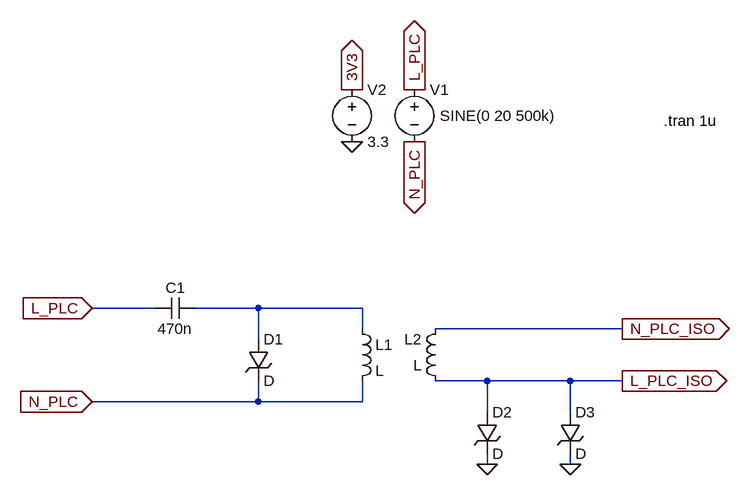
[diagram p0: schematic scratch.asc]
scratch.asc, the LTspice schematic file:
Version 4.1
SHEET 1 980 680
WIRE 64 80 -32 80
WIRE 224 80 128 80
WIRE 384 80 224 80
WIRE 384 112 384 80
WIRE 784 112 496 112
WIRE 224 128 224 80
WIRE 576 192 496 192
WIRE 704 192 576 192
WIRE 784 192 704 192
WIRE 224 224 224 192
WIRE 224 224 -32 224
WIRE 384 224 384 192
WIRE 384 224 224 224
WIRE 576 240 576 192
WIRE 704 240 704 192
WIRE 576 320 576 304
WIRE 704 320 704 304
FLAG -32 80 L_PLC
IOPIN -32 80 In
FLAG -32 224 N_PLC
IOPIN -32 224 In
FLAG 784 112 N_PLC_ISO
IOPIN 784 112 Out
FLAG 784 192 L_PLC_ISO
IOPIN 784 192 Out
FLAG 576 320 0
FLAG 464 -256 L_PLC
IOPIN 464 -256 Out
FLAG 464 -176 N_PLC
IOPIN 464 -176 Out
FLAG 368 -256 3V3
IOPIN 368 -256 Out
FLAG 368 -176 0
FLAG 704 320 0
SYMBOL cap 128 64 R90
WINDOW 0 0 32 VBottom 2
WINDOW 3 32 32 VTop 2
SYMATTR InstName C1
SYMATTR Value 470n
SYMBOL ind 512 208 R180
WINDOW 0 36 80 Left 2
WINDOW 3 36 40 Left 2
SYMATTR InstName L2
SYMBOL voltage 464 -272 R0
WINDOW 3 39 56 Left 2
WINDOW 123 0 0 Left 0
WINDOW 39 0 0 Left 0
SYMATTR Value SINE(0 20 500k)
SYMATTR InstName V1
SYMBOL voltage 368 -272 R0
WINDOW 123 0 0 Left 0
WINDOW 39 0 0 Left 0
SYMATTR InstName V2
SYMATTR Value 3.3
SYMBOL ind 368 96 R0
SYMATTR InstName L1
SYMBOL TVSdiode 208 128 R0
SYMATTR InstName D1
SYMBOL TVSdiode 560 240 R0
SYMATTR InstName D2
SYMBOL TVSdiode 688 240 R0
SYMATTR InstName D3
TEXT 848 -208 Left 2 !.tran 1u

The netlist it stands for:
* scratch.asc
C1 N001 L_PLC 470n
L2 L_PLC_ISO N_PLC_ISO L
V1 L_PLC N_PLC SINE(0 20 500k)
V2 3V3 0 3.3
L1 N001 N_PLC L
D1 N001 N_PLC D
D2 L_PLC_ISO 0 D
D3 L_PLC_ISO 0 D
.model D D
.lib standard.dio
.tran 1u
.backanno
.end